# Altium schematic sheet ESC_Tester_SCH.SchDoc
size A4; DrawnBy: Hama; SheetNumber: 1; SheetTotal: 1
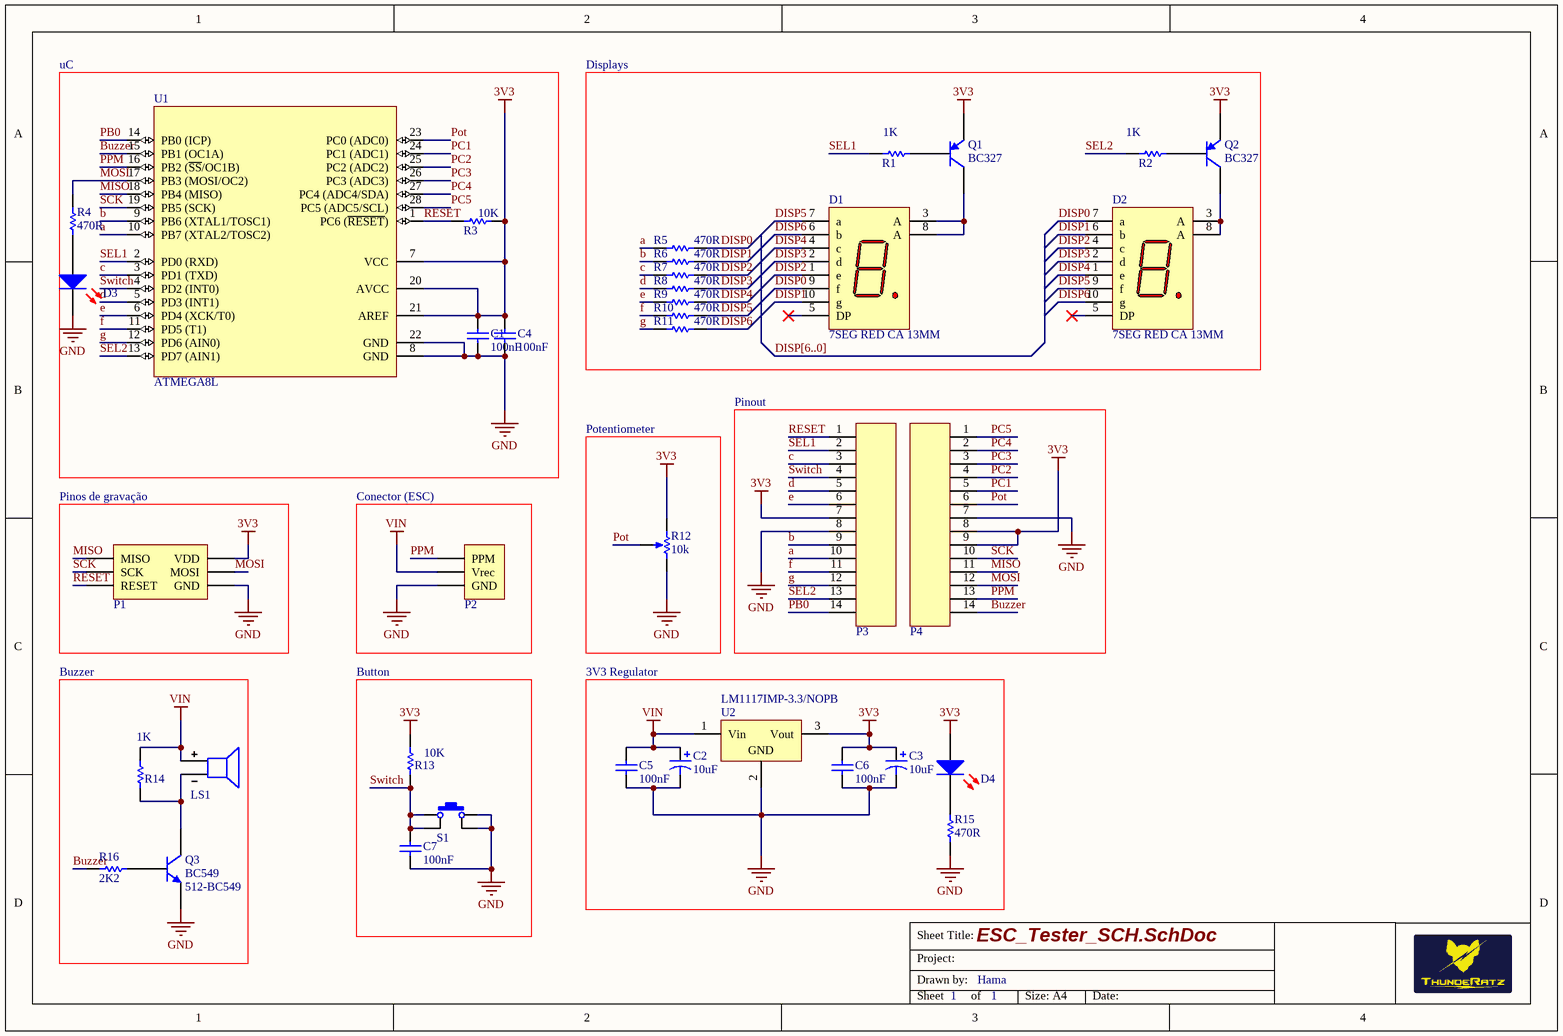
[diagram p0: ESC_Tester_SCH.SchDoc]

## Parts
C1  Capacitance: 100nF  [Cap Film 0.1uF]  (hidden comment: Cap Film 0.1uF)
C2  10uF  [CAP RAD 10UF 35V]
C3  10uF  [CAP RAD 10UF 35V]
C4  Capacitance: 100nF  [Cap Film 0.1uF]  (hidden comment: Cap Film 0.1uF)
C5  Capacitance: 100nF  [Cap Film 0.1uF]  (hidden comment: Cap Film 0.1uF)
C6  Capacitance: 100nF  [Cap Film 0.1uF]  (hidden comment: Cap Film 0.1uF)
C7  Capacitance: 100nF  [Cap Film 0.1uF]  (hidden comment: Cap Film 0.1uF)
D1  7SEG RED CA 13MM  [7SEG RED PTH]
D2  7SEG RED CA 13MM  [7SEG RED PTH]
D3  LED 5MM RED  [LED 5MM RED]  (value not drawn)
D4  LED 5MM RED  [LED 5MM RED]  (value not drawn)
LS1  Buzzer  [BUZZER 12x6MM]  (value not drawn)
P1  87758-4016  [HDR MALE 2x3]  (value not drawn)
P2  920-0018-01  [HDR MALE 1x3]  (value not drawn)
P3  Header Female 1x14  [HDR FEMALE 1x14]  (value not drawn)
P4  Header Female 1x14  [HDR FEMALE 1x14]  (value not drawn)
Q1  BC327  [TO92]
Q2  BC327  [TO92]
Q3  BC549  Supplier Part Number 1: 512-BC549  [TO92]
R1  Resistance (Ohms): 1K  [RES 1K 1/4W CARBON FILM]  (hidden comment: RES 1K 1/4W CARBON FILM)
R2  Resistance (Ohms): 1K  [RES 1K 1/4W CARBON FILM]  (hidden comment: RES 1K 1/4W CARBON FILM)
R3  Resistance (Ohms): 10K  [RES 10K 1/4W CARBON FILM]  (hidden comment: RES 10K 1/4W CARBON FILM)
R4  Resistance (Ohms): 470R  [RES 470R 1/4W CARBON FILM_STAND]  (hidden comment: RES 470R 1/4W CARBON FILM)
R5  Resistance (Ohms): 470R  [RES 470R 1/4W CARBON FILM]  (hidden comment: RES 470R 1/4W CARBON FILM)
R6  Resistance (Ohms): 470R  [RES 470R 1/4W CARBON FILM]  (hidden comment: RES 470R 1/4W CARBON FILM)
R7  Resistance (Ohms): 470R  [RES 470R 1/4W CARBON FILM]  (hidden comment: RES 470R 1/4W CARBON FILM)
R8  Resistance (Ohms): 470R  [RES 470R 1/4W CARBON FILM]  (hidden comment: RES 470R 1/4W CARBON FILM)
R9  Resistance (Ohms): 470R  [RES 470R 1/4W CARBON FILM]  (hidden comment: RES 470R 1/4W CARBON FILM)
R10  Resistance (Ohms): 470R  [RES 470R 1/4W CARBON FILM]  (hidden comment: RES 470R 1/4W CARBON FILM)
R11  Resistance (Ohms): 470R  [RES 470R 1/4W CARBON FILM]  (hidden comment: RES 470R 1/4W CARBON FILM)
R12  Resistance (Ohms): 10k  [Pot 10k]  (hidden comment: Pot 10k)
R13  Resistance (Ohms): 10K  [RES 10K 1/4W CARBON FILM]  (hidden comment: RES 10K 1/4W CARBON FILM)
R14  Resistance (Ohms): 1K  [RES 1K 1/4W CARBON FILM]  (hidden comment: RES 1K 1/4W CARBON FILM)
R15  Resistance (Ohms): 470R  [RES 470R 1/4W CARBON FILM_STAND]  (hidden comment: RES 470R 1/4W CARBON FILM)
R16  Resistance (Ohms): 2K2  [RES 2K2 1/4W CARBON FILM]  (hidden comment: RES 2K2 1/4W CARBON FILM)
S1  SPST-NO  [TACT SWITCH 6X6X7MM]  (value not drawn)
U1  ATMEGA8L  [DIP28]
U2  LM1117IMP-3.3/NOPB  [TO220AB]

## Blocks framed on the sheet
uC: C1 C4 D3 R3 R4 U1
Displays: D1 D2 Q1 Q2 R1 R2 R5-R11
Pinout: P3 P4
Potentiometer: R12
Pinos de gravação: P1
Conector (ESC): P2
Buzzer: LS1 Q3 R14 R16
Button: C7 R13 S1
3V3 Regulator: C2 C3 C5 C6 D4 R15 U2

## Nets
3V3: C1.2 C3.1 C4.2 C6.2 D4.1(A) P1.5(VDD) P3.7 P4.8 P4.9 Q1.3(E) Q2.3(E) R3.2 R12.3(BOT) R13.2 U1.7(VCC) U1.20(AVCC) U1.21(AREF) U2.3(Vout)
GND: C1.1 C2.2 C3.2 C4.1 C5.1 C6.1 C7.1 D3.2(K) P1.1(GND) P2.3(GND) P3.8 P4.7 Q3.3(E) R12.1(TOP) R15.2 S1.3 S1.4 U1.8(GND) U1.22(GND) U2.2(GND)
VIN: C2.1 C5.2 LS1.1 P2.2(Vrec) R14.2 U2.1(Vin)
a: P3.10 R5.1 U1.10(PB7_(XTAL2/TOSC2))
b: P3.9 R6.1 U1.9(PB6_(XTAL1/TOSC1))
Buzzer: P4.14 R16.1 U1.15(PB1_(OC1A))
c: P3.3 R7.1 U1.3(PD1_(TXD))
d: P3.5 R8.1 U1.5(PD3_(INT1))
DISP0: D1.9(f) D2.7(a) R5.2
DISP1: D1.10(g) D2.6(b) R6.2
DISP2: D1.1(e) D2.4(c) R7.2
DISP3: D1.2(d) D2.2(d) R8.2
DISP4: D1.4(c) D2.1(e) R9.2
DISP5: D1.7(a) D2.9(f) R10.2
DISP6: D1.6(b) D2.10(g) R11.2
e: P3.6 R9.1 U1.6(PD4_(XCK/T0))
f: P3.11 R10.1 U1.11(PD5_(T1))
g: P3.12 R11.1 U1.12(PD6_(AIN0))
MISO: P1.6(MISO) P4.11 U1.18(PB4_(MISO))
MOSI: P1.3(MOSI) P4.12 R4.2 U1.17(PB3_(MOSI/OC2))
PB0: P3.14 U1.14(PB0_(ICP))
PC1: P4.5 U1.24(PC1_(ADC1))
PC2: P4.4 U1.25(PC2_(ADC2))
PC3: P4.3 U1.26(PC3_(ADC3))
PC4: P4.2 U1.27(PC4_(ADC4/SDA))
PC5: P4.1 U1.28(PC5_(ADC5/SCL))
Pot: P4.6 R12.2(TAP) U1.23(PC0_(ADC0))
PPM: P2.1(PPM) P4.13 U1.16(PB2_(~{SS}/OC1B))
RESET: P1.2(RESET) P3.1 R3.1 U1.1(PC6_(~{RESET}))
SCK: P1.4(SCK) P4.10 U1.19(PB5_(SCK))
SEL1: P3.2 R1.1 U1.2(PD0_(RXD))
SEL2: P3.13 R2.1 U1.13(PD7_(AIN1))
Switch: C7.2 P3.4 R13.1 S1.1 S1.2 U1.4(PD2_(INT0))
NetD1_3: D1.3(A) D1.8(A) Q1.1(C)
NetD2_3: D2.3(A) D2.8(A) Q2.1(C)
NetD3_1: D3.1(A) R4.1
NetD4_2: D4.2(K) R15.1
NetLS1_2: LS1.2 Q3.1(C) R14.1
NetQ1_2: Q1.2(B) R1.2
NetQ2_2: Q2.2(B) R2.2
NetQ3_2: Q3.2(B) R16.2

Not connected (* = marked no-connect by the designer): D1 5(DP)*; D2 5(DP)*

## Buses and harness runs
bus DISP[6..0]

## Notes on the sheet
- Sheet Title:
- Project:
- Drawn by:
- Sheet
- of
- Size: A4
- Date:

## Library data of the parts
C1 C4-C7 = Cap Film 0.1uF - B32529C104K: Cap Film 0.1uF 63V PET 10% (7.2 X 2.5 X 6.5mm) Radial 5mm 125C Bulk; Manufacturer: TDK EPCOS; Material: PVC,Resin; Voltage Rating (AC): 40V; Life (Hours): 200000Hour; Insulation Resistance: 15GR; Lead Diameter: 0.5mm; Lead Length: 6mm; Supplier 1: Newark; Manufacturer Part Number: B32529C104K; Stock 1: 0; Mount: PCB,Through Hole; Case/Package: Radial; Number of Pins: 2; Dielectric Material: PET; Contact Plating: Matte,Tin; Min Operating Temperature: -55°C; Max Operating Temperature: 125°C; Voltage Rating: 63V; Tolerance: 10%; Packaging: Bulk; Voltage Rating (DC): 63V; Package Quantity: 2000; Termination: Radial; Dielectric: PET; Length: 7.2mm; Height: 6.5mm; Lead Pitch: 5mm; Width: 2.5mm; Height - Seated (Max): 0.256inch; Depth: 2.5mm; Pitch: 5mm; Radiation Hardening: No; REACH SVHC: No SVHC; Lead Free: Lead Free; ComponentLink1URL: http://www.farnell.com/datasheets/8708.pdf?src-supplier=Element14; ComponentLink1Description: http://www.farnell.com/datasheets/8708.pdf?src-supplier=Element14; ComponentLink2URL: https://www.distrelec.biz/Web/Downloads/_t/ds/b3252x_eng_tds.pdf?mime=application%2Fpdf&src-supplier=Distrelec; ComponentLink2Description: https://www.distrelec.biz/Web/Downloads/_t/ds/b3252x_eng_tds.pdf?mime=application%2Fpdf&src-supplier=Distrelec; ComponentLink3URL: http://www.farnell.com/datasheets/1955213.pdf?src-supplier=Farnell; ComponentLink3Description: http://www.farnell.com/datasheets/1955213.pdf?src-supplier=Farnell; ComponentLink4URL: https://www.verical.com/server-webapp/html/getDatasheet?partID=117180&src-supplier=Verical; ComponentLink4Description: https://www.verical.com/server-webapp/html/getDatasheet?partID=117180&src-supplier=Verical; ComponentLink5URL: https://produktinfo.conrad.com/datenblaetter/500000-524999/500871-da-01-en-METALLPOLYESTER_KONDENSATOR_0_10_UF.pdf?src-supplier=Conrad; ComponentLink5Description: https://produktinfo.conrad.com/datenblaetter/500000-524999/500871-da-01-en-METALLPOLYESTER_KONDENSATOR_0_10_UF.pdf?src-supplier=Conrad; Supplier Part Number 1: 21C0469
C2 C3 = CAP ELE RAD 10uF 16V: Manufacturer Part Number: IMP1295; Product Range: MCGPR Series; Capacitance Tolerance: ± 20%; Voltage Rating: 16; Capacitor Terminals: Radial Leaded; Lifetime @ Temperature: 2000 hours @ 85; SVHC: No SVHC (15-Jun-2015); Leakage Current: 6; Supplier 1: Mult Comercial; Manufacturer: -; RoHS: YES; Stock 1: 33826; Pricing 1: 1=0.50 (BRL); Capacitance: 10uF; Diameter: 5; Packaging: Each; ESR: -; Height: 11; Lead Spacing: 2; Operating Temperature Min: -40; Operating Temperature Max: 85; Capacitance Tolerance ±: ± 20%; Operating Temperature Range: -40°C to +85°C<!--FANDB--><div class="features-and-benefits-container"><div class="features-and-benefits-description"><span class="features-benefits-value">The Multicomp MCGPR series capacitors are general purpose, radial leaded polarized aluminium electrolytic capacitors. MCGPR series parts cover broad range of voltage ratings and capacitance values.</span></div><div class="features-and-benefits-list"><ul class="features-and-benefits-list-list"><li class="features-and-benefits-list-item">Capacitance value ranges from 0.1µF to 22000µF for 6.3VDC to 100VDC</li><li class="features-and-benefits-list-item">Capacitance value ranges from 0.47µF to 820µF for 160VDC to 450VDC</li><li class="features-and-benefits-list-item">Tolerance of ±20%</li><li class="features-and-benefits-list-item">Endurance of 2000h at 85°C</li><li class="features-and-benefits-list-item">Available in -40°C to 85°C and -25°C to 85; ComponentLink1URL: http://loja.multcomercial.com.br/capacitor-eletrolitico-10uf-16v.html; ComponentLink1Description: http://loja.multcomercial.com.br/capacitor-eletrolitico-10uf-16v.html; Supplier Part Number 1: Capacitor Eletrolítico 10uF/16V
D1 D2 = 7SEG RED CA 13MM: PHOTONIC - PHDE113A - DISPLAY, SEVEN SEGMENT, 13MM, RED; No. of Digits / Alpha: 1; Character Size: 13; Common Connection: Common Anode; Luminous Intensity: 1800 ucd; Forward Current If: 30mA; Forward Voltage: 2.1; Supplier 1: Mult Comercial; Manufacturer: Photonic; Manufacturer Part Number: PHDE113A; RoHS: YES; Stock 1: 0; Pricing 1: 1=3.70 (BRL); LED Color: Red; Packaging: Each; Colour: Red; ComponentLink1URL: http://loja.multcomercial.com.br/display-de-7-segmentos-anodo-comum-vermelho-alta-intensidade-phde113a-politronic.html; ComponentLink1Description: http://loja.multcomercial.com.br/display-de-7-segmentos-anodo-comum-vermelho-alta-intensidade-phde113a-politronic.html; ComponentLink2URL: http://www.politronic.com.br/especs/dis/PHDX113.pdf; ComponentLink2Description: http://www.politronic.com.br/especs/dis/PHDX113.pdf; Supplier Part Number 1: Display de 7 Segmentos Anodo Comum Vermelho Alta Intensidade PHDE113A - Politronic
D3 D4 = LED 5MM RED: Manufacturer: Paralight; Manufacturer Part Number: IMP585; Bulb Size: 3mm; Wavelength Typ: 625; Forward Voltage: 2; Forward Current If: 20; Luminous Intensity: 3; LED Mounting: Through Hole; Lens Shape: Round; Viewing Angle: 60°; SVHC: No SVHC (15-Jun-2015); External Diameter: 2.9; External Length / Height: 4.6; Forward Voltage VF Max: 2.5; LED / Lamp Size: 3mm / T-1; LED Type: Standard; Lead Cross-section Depth: 0.5; Luminous Intensity @ If Min: 0.7; PIV Max: 5; Peak Forward Current: 7; Voltage Vf Typ: 2.2V<!--FANDB--><div class="features-and-benefits-container"><div class="features-and-benefits-description"><span class="features-benefits-value">The L-934LID from Kingbright is a through hole round shape high efficiency red colour LED. The device is made of gallium arsenide phosphide on gallium phosphide orange light emitting diode. This LED is widely used because of low power consumption, long life and solid state reliability.</span></div><div class="features-and-benefits-list"><ul class="features-and-benefits-list-list"><li class="features-and-benefits-list-item">Standard bulb size of T-1 (3mm)</li><li class="features-and-benefits-list-item">Reliable and rugged</li><li class="features-and-benefits-list-item">Viewing angle is 60°</li><li class="features-and-benefits-list-item">Luminous intensity of 3mcd at 2mA</li><li class="features-and-benefits-list-item">Forward voltage is 2.0V</li><li class="features-and-benefits-list-item">Forward current (If) is 20mA</li><li class="features-and-benefits-list-item">Dominant wavelength is 625nm at IF=20mA</li><li class="features-and-benefits-list-item">Peak wavelength is 627nm at IF=20; Supplier 1: Mult Comercial; RoHS: YES; Stock 1: 35260; Pricing 1: 1=0.15 (BRL); LED Colour: Red; Packaging: Each; MSL: -; Current If Luminous Intensity: 2; Dominant Wavelength: 625; Forward Current If Max: 20; Lead Cross-section Width: 0.5; Lead Spacing: 2.54; Luminous Intensity Typ: 3; Mounting Type: PCB Through Hole; No. of Pins: 2; Operating Temperature Max: 85; Operating Temperature Min: -40; Operating Temperature Range: -40°C to +85; Peak Wavelength: 625; ComponentLink1URL: http://loja.multcomercial.com.br/led-3mm-vermelho-difuso-l-314hd-paralight.html; ComponentLink1Description: http://loja.multcomercial.com.br/led-3mm-vermelho-difuso-l-314hd-paralight.html; Supplier Part Number 1: Led 3mm Vermelho Difuso L-314HD - Paralight
LS1 = AUDIO PIEZO TRANSDUCER 30V TH: Manufacturer: TDK Corporation; Manufacturer Part Number: PS1240P02BT; Driver Circuitry: Transducer, Externally Driven; Input Type: Zero-Peak Signal; Voltage - Rated: 3V; Voltage Range: 30V (Max); Frequency: 4kHz; Operating Mode: Single Tone; Sound Pressure Level: 60dB @ 3V, 10cm; Port Location: Top; Supplier 1: Digi-Key; RoHS: RoHS Compliant; Category: Audio Products; Stock 1: 23730; Pricing 1: 1=0.72, 10=0.622, 100=0.3889, 250=0.37776 (USD); Packaging: Cut Tape (CT); Part Status: Active; Technology: Piezo; Duration: -; Current - Supply: -; Operating Temperature: -10°C ~ 70°C; Approvals: -; Ratings: -; Mounting Type: Through Hole; Termination: PC Pins; Size / Dimension: 0.480" Dia (12.20mm); Height - Seated (Max): 0.307" (7.80mm); ComponentLink1URL: https://product.tdk.com/info/en/catalog/datasheets/ef532_ps.pdf; ComponentLink1Description: https://product.tdk.com/info/en/catalog/datasheets/ef532_ps.pdf; Supplier Part Number 1: 445-2525-1-ND
P1 = 87758-4016: Headers & Wire Housings VERT HEADER 40P Lead Free; Manufacturer: Molex; Current Rating: 2 A; Mounting Angle: Vertical; Number of Positions: 40 Position; Voltage Rating: 125 V; Pitch: 2 mm; Supplier 1: Mouser; Manufacturer Part Number: 87758-4016; RoHS: RoHS Compliant; Category: Headers & Wire Housings; Stock 1: 704; Pricing 1: 1=3.82, 10=2.96, 100=2.51, 500=2.29, 1000=2.08, 2000=1.98, 5000=1.87 (AUD); Accessory Type: -; Contact Plating: Gold; Contact Type: -; Housing Material: Nylon; Number of Rows: 2 Row; Packaging: Tray; Product: Headers; Series: 87758; Termination Style: Through Hole; Type: Breakaway; Brand: Molex; Contact Material: Phosphor Bronze; Mounting Style: Through Hole; Row Spacing: 2 mm; Contact Gender: Pin (Male); Product Category: 2mm Connectors; Standard Pack Qty: 900; Tradename: Milli-Grid; RoHS - Mouser: Y; Minimum Order Quantity: 1; Reeling: False; ComponentLink1URL: http://www.mouser.com/ds/2/276/0877584016_PCB_HEADERS-176369.pdf; ComponentLink1Description: http://www.mouser.com/ds/2/276/0877584016_PCB_HEADERS-176369.pdf; Supplier Part Number 1: 538-87758-4016
P2 = 920-0018-01_1: Headers & Wire Housings 40Pin 2mm Spacing Single Row Hdrs, 5pc; Manufacturer: SchmartBoard; Mounting Angle: Vertical; Number of Positions: 40 Position; Supplier 1: Mouser; Manufacturer Part Number: 920-0018-01; RoHS: RoHS Compliant; Category: Headers & Wire Housings; Stock 1: 14; Pricing 1: 1=7.43, 5=7.05 (AUD); Accessory Type: -; Contact Plating: Gold; Contact Type: -; Number of Rows: 1 Row; Product: Headers; Termination Style: Through Hole; Type: Breakaway; Brand: SchmartBoard; Mounting Style: Straight Pin; Pitch: 2 mm; Row Spacing: -; Contact Gender: Pin (Male); Product Category: Accessories; RoHS - Mouser: Y; Minimum Order Quantity: 1; Reeling: False; ComponentLink1URL: http://www.mouser.com/ds/2/356/SchmartBoard_920-0018-01-305856.pdf; ComponentLink1Description: http://www.mouser.com/ds/2/356/SchmartBoard_920-0018-01-305856.pdf; Supplier Part Number 1: 872-920-0018-01
P3 P4 = Header Female 1x14: Headers & Wire Housings 40Pin 2mm Spacing Single Row Hdrs, 5pc; Manufacturer: Cromax; Mounting Angle: Vertical; Number of Positions: 40 Position; Supplier 1: -; Manufacturer Part Number: -; RoHS: RoHS Compliant; Category: Headers & Wire Housings; Stock 1: 14; Pricing 1: 1=1.60, 2=0.80 (BRL); Accessory Type: -; Contact Plating: Gold; Contact Type: -; Number of Rows: 1 Row; Product: Headers; Termination Style: Through Hole; Type: Breakaway; Brand: Cromax; Mounting Style: Straight Pin; Pitch: 2 mm; Row Spacing: -; Contact Gender: Pin (Female); Product Category: Accessories; RoHS - Mouser: Y; Minimum Order Quantity: 1; Reeling: False; ComponentLink1URL: -; ComponentLink1Description: -; Supplier Part Number 1: -
Q1 Q2 = BC327 BJT PNP TO92: Bipolar Transistors - BJT PNP -45V -800mA HFE/630; Manufacturer: Fairchild Semiconductor; Collector- Base Voltage VCBO: - 50 V; Configuration: Single; DC Current Gain hFE Max: 630; Emitter- Base Voltage VEBO: - 5 V; Collector-Emitter Saturation Voltage: - 0.7 V; DC Collector/Base Gain hfe Min: 100; Gain Bandwidth Product fT: 100 MHz; Maximum DC Collector Current: 0.8 A; Pd - Power Dissipation: 625 mW; Product Status: Obsolete; Supplier 1: Mult Comercial; Manufacturer Part Number: BC327; RoHS: RoHS Compliant; Category: Bipolar Transistors - BJT; Stock 1: 0; Collector- Emitter Voltage VCEO Max: - 45 V; Package / Case: TO-92; Packaging: Bulk; Series: BC327; Brand: Fairchild Semiconductor; Mounting Style: Through Hole; Transistor Polarity: PNP; Maximum Operating Temperature: + 150 C; Minimum Operating Temperature: - 55 C; Standard Pack Qty: 2000; RoHS - Mouser: Y; Minimum Order Quantity: 1; Reeling: False; ComponentLink1URL: http://loja.multcomercial.com.br/transistor-bc237-25-pnp-to-92-cod-loja-14-fairchild.html; ComponentLink1Description: http://loja.multcomercial.com.br/transistor-bc237-25-pnp-to-92-cod-loja-14-fairchild.html; Supplier Part Number 1: Transistor BC327-25 PNP TO-92 - Cód. Loja 14 - FAIRCHILD; Pricing 1: 1=0.20 (BRL)
Q3 = BC549: TRANS NPN 30V 0.1A TO-92; Manufacturer: Fairchild Semiconductor; Configuration: Single; Emitter- Base Voltage VEBO: 5 V; Collector-Emitter Saturation Voltage: 200 mV; Gain Bandwidth Product fT: 300 MHz; DC Collector/Base Gain hfe Min: 110; DC Current Gain hFE Max: 800; Maximum Power Dissipation: 0.5 W; Supplier 1: Mouser; Manufacturer Part Number: BC549; Product Category: Bipolar Transistors - BJT; RoHS: Details; Transistor Polarity: NPN; Collector- Base Voltage VCBO: 30 V; Collector- Emitter Voltage VCEO Max: 30 V; Maximum DC Collector Current: 0.1 A; Maximum Operating Temperature: + 150 C; Mounting Style: Through Hole; Package / Case: TO-92-3; Brand: Fairchild Semiconductor; Minimum Operating Temperature: - 65 C; Packaging: Bulk; Series: BC549; Factory Pack Quantity: 2000; ComponentLink1URL: https://datasheet.ciiva.com/982/bc546-982130.pdf; ComponentLink1Description: https://datasheet.ciiva.com/982/bc546-982130.pdf; ComponentLink2URL: https://datasheet.ciiva.com/17179/bc549-17179663.pdf; ComponentLink2Description: https://datasheet.ciiva.com/17179/bc549-17179663.pdf
R1 R2 R14 = RES 1K 1/4W CARBON FILM: RES 1K OHM 1/4W 5% CARBON FILM; Manufacturer: Ty-Ohm; Manufacturer Part Number: CR25; Power (Watts): 0.25W, 1/4W; Temperature Coefficient: 0/ -500ppm/°C; Supplier 1: Mult Comercial; RoHS: RoHS Compliant; Category: Resistors; Stock 1: 617543; Pricing 1: 1=0.20 (BRL); Packaging: Cut Tape (CT); Tolerance: ±5%; Composition: Carbon Film; Features: Flame Retardant Coating, Safety; Operating Temperature: -55°C ~ 155°C; Package / Case: Axial; Supplier Device Package: Axial; Size / Dimension: 0.091" Dia x 0.256" L (2.30mm x 6.50mm); Height: -; Number of Terminations: 2; ComponentLink1URL: http://loja.multcomercial.com.br/resistor-de-1-4-de-watt-cr25-5-de-tolerancia.html; ComponentLink1Description: http://loja.multcomercial.com.br/resistor-de-1-4-de-watt-cr25-5-de-tolerancia.html; Supplier Part Number 1: Resistor de Filme de Carbono 1/4 de Watt CR25 5% de tolerância - 0.22R Ω à 10M Ω
R3 R13 = RES 10K 1/4W CARBON FILM: RES 10K OHM 1/4W 5% CARBON FILM; Manufacturer: Ty-Ohm; Manufacturer Part Number: CR25; Power (Watts): 0.25W, 1/4W; Temperature Coefficient: 0/ -500ppm/°C; Supplier 1: Mult Comercial; RoHS: RoHS Compliant; Category: Resistors; Stock 1: 617543; Pricing 1: 1=0.20 (BRL); Packaging: Cut Tape (CT); Tolerance: ±5%; Composition: Carbon Film; Features: Flame Retardant Coating, Safety; Operating Temperature: -55°C ~ 155°C; Package / Case: Axial; Supplier Device Package: Axial; Size / Dimension: 0.091" Dia x 0.256" L (2.30mm x 6.50mm); Height: -; Number of Terminations: 2; ComponentLink1URL: http://loja.multcomercial.com.br/resistor-de-1-4-de-watt-cr25-5-de-tolerancia.html; ComponentLink1Description: http://loja.multcomercial.com.br/resistor-de-1-4-de-watt-cr25-5-de-tolerancia.html; Supplier Part Number 1: Resistor de Filme de Carbono 1/4 de Watt CR25 5% de tolerância - 0.22R Ω à 10M Ω
R4-R11 R15 = RES 470R 1/4W CARBON FILM: RES 470R OHM 1/4W 5% CARBON FILM; Manufacturer: Ty-Ohm; Manufacturer Part Number: CR25; Power (Watts): 0.25W, 1/4W; Temperature Coefficient: 0/ -500ppm/°C; Supplier 1: Mult Comercial; RoHS: RoHS Compliant; Category: Resistors; Stock 1: 617543; Pricing 1: 1=0.20 (BRL); Packaging: Cut Tape (CT); Tolerance: ±5%; Composition: Carbon Film; Features: Flame Retardant Coating, Safety; Operating Temperature: -55°C ~ 155°C; Package / Case: Axial; Supplier Device Package: Axial; Size / Dimension: 0.091" Dia x 0.256" L (2.30mm x 6.50mm); Height: -; Number of Terminations: 2; ComponentLink1URL: http://loja.multcomercial.com.br/resistor-de-1-4-de-watt-cr25-5-de-tolerancia.html; ComponentLink1Description: http://loja.multcomercial.com.br/resistor-de-1-4-de-watt-cr25-5-de-tolerancia.html; Supplier Part Number 1: Resistor de Filme de Carbono 1/4 de Watt CR25 5% de tolerância - 0.22R Ω à 10M Ω
R12 = Pot 10k: POT 10K OHM 1/20W PLASTIC LINEAR; Manufacturer: TT Electronics/BI; Manufacturer Part Number: P120PK-Y25BR10K; Tolerance: ±20%; Built in Switch: None; Power (Watts): 0.05W, 1/20W; Number of Turns: 1; Rotation: 300°; Adjustment Type: Top Adjustment; Resistive Material: Conductive Plastic; Actuator Type: Knurled; Actuator Length: 0.984" (25.00mm); Actuator Diameter: 0.236" (6.00mm); Supplier 1: Digi-Key; RoHS: RoHS Compliant; Category: Potentiometers, Variable Resistors; Stock 1: 1210; Pricing 1: 1=0.6, 10=0.553, 25=0.4932, 50=0.476, 100=0.442, 250=0.43352, 500=0.3995, 1000=0.34, 5000=0.2805 (USD); Packaging: Tray; Part Status: Active; Taper: Linear; Temperature Coefficient: -; Termination Style: PC Pins, Board Locks; Bushing Thread: -; Mounting Type: Through Hole, Snap In; ComponentLink1URL: http://www.ttelectronics.com/sites/default/files/download-files/Datasheet_RotaryPanelPot_P120series.pdf; ComponentLink1Description: http://www.ttelectronics.com/sites/default/files/download-files/Datasheet_RotaryPanelPot_P120series.pdf; Supplier Part Number 1: 987-1710-ND
R16 = RES 2K2 1/4W CARBON FILM: RES 2K2 OHM 1/4W 5% CARBON FILM; Manufacturer: Ty-Ohm; Manufacturer Part Number: CR25; Power (Watts): 0.25W, 1/4W; Temperature Coefficient: 0/ -500ppm/°C; Supplier 1: Mult Comercial; RoHS: RoHS Compliant; Category: Resistors; Stock 1: 617543; Pricing 1: 1=0.20 (BRL); Packaging: Cut Tape (CT); Tolerance: ±5%; Composition: Carbon Film; Features: Flame Retardant Coating, Safety; Operating Temperature: -55°C ~ 155°C; Package / Case: Axial; Supplier Device Package: Axial; Size / Dimension: 0.091" Dia x 0.256" L (2.30mm x 6.50mm); Height: -; Number of Terminations: 2; ComponentLink1URL: http://loja.multcomercial.com.br/resistor-de-1-4-de-watt-cr25-5-de-tolerancia.html; ComponentLink1Description: http://loja.multcomercial.com.br/resistor-de-1-4-de-watt-cr25-5-de-tolerancia.html; Supplier Part Number 1: Resistor de Filme de Carbono 1/4 de Watt CR25 5% de tolerância - 0.22R Ω à 10M Ω
S1 = SWITCH TACTILE SPST-NO 0.02A 15V: Manufacturer: Panasonic Electronic Components; Manufacturer Part Number: EVQ-PAC07K; Switch Function: Off-Mom; Contact Rating @ Voltage: 0.02A @ 15VDC; Actuator Type: Standard; Actuator Height off PCB, from Pins: 7.00mm; Actuator Orientation: Top Actuated; Outline: 6.00mm x 6.00mm; Illumination: Non-Illuminated; Operating Force: 100gf; Switch Travel: 0.25mm; Mechanical Life: 100,000 Cycles; Supplier 1: Digi-Key; RoHS: RoHS Compliant; Category: Switches; Stock 1: 19805; Pricing 1: 1=0.27, 10=0.254, 25=0.2168, 50=0.1896, 100=0.176, 250=0.15572, 500=0.14894, 1000=0.12186, 5000=0.10832 (USD); Packaging: Bulk; Part Status: Active; Circuit: SPST-NO; Mounting Type: Through Hole; Termination Style: PC Pin; Illumination Voltage (Nominal): -; Illumination Type, Color: -; Ingress Protection: -; Features: -; Actuator Material: -; Operating Temperature: -20°C ~ 70°C; ComponentLink1URL: http://industrial.panasonic.com/cdbs/www-data/pdf/ATK0000/ATK0000CE10.pdf; ComponentLink1Description: http://industrial.panasonic.com/cdbs/www-data/pdf/ATK0000/ATK0000CE10.pdf; Supplier Part Number 1: P8011S-ND
U1 = MCU ATMEGA8L-8PU PDIP28_1: 8-bit Microcontrollers - MCU 8kB Flash 0.5kB EEPROM 23 I/O Pins; Manufacturer: Atmel; Data RAM Size: 1 kB; Data RAM Type: SRAM; Data ROM Size: 512 B; Interface Type: SPI, TWI, USART; Number of I/Os: 23 I/O; Core: AVR; Data Bus Width: 8 bit; Maximum Clock Frequency: 8 MHz; Number of Timers/Counters: 3 Timer; Operating Supply Voltage: 2.7 V to 5.5 V; Processor Series: megaAVR; Supply Voltage - Max: 5.5 V; Supply Voltage - Min: 2.7 V; Supplier 1: Mult Comercial; Manufacturer Part Number: ATmega8L-8PU; RoHS: RoHS Compliant; Category: 8-bit Microcontrollers - MCU; Pricing 1: 1=8.70 (BRL); Package / Case: DIP-28; Packaging: Tray; Product: MCU; Program Memory Type: Flash; Series: ATMEGA 8; Brand: Atmel; Data ROM Type: EEPROM; Mounting Style: SMD/SMT; Program Memory Size: 8 kB; Maximum Operating Temperature: + 85 C; Minimum Operating Temperature: - 40 C; Product Category: Microcontrollers - RISC; Standard Pack Qty: 1; Tradename: ATMEGA; Minimum Order Quantity: 1; Reeling: False; ComponentLink1URL: http://loja.multcomercial.com.br/microcontrolador-atmega88pa-pu-dip28-cod-loja-748-atmel-2.html; ComponentLink1Description: http://loja.multcomercial.com.br/microcontrolador-atmega88pa-pu-dip28-cod-loja-748-atmel-2.html; Supplier Part Number 1: Microcontrolador ATMEGA8L-8PU DIP28 - Cód. Loja 472- Atmel; Supplier Part Number 2: Soquete estampado slim MAC28 28 pinos - Cód. Loja 2260 E 2261; ComponentLink2Description: http://loja.multcomercial.com.br/soquete-estampado-slim-mac28-28-pinos-cod-loja-2260-e-2261.html; ComponentLink2URL: http://loja.multcomercial.com.br/soquete-estampado-slim-mac28-28-pinos-cod-loja-2260-e-2261.html
U2 = LM1117IMP-3.3/NOPB: TEXAS INSTRUMENTS   LM1117IMP-3.3/NOPB   LDO, 1.2VDO, 3.3V, 1%, 0.8A, 3SOT223; Maximum Dropout Voltage @ Current: 1.3V@100mA|1.35V@500mA|1.4V@800mA; Maximum Input Voltage: 15V; Maximum Output Current: 1.5A; Maximum Quiescent Current: 15mA; Number of Outputs: 1; Typical Quiescent Current: 5mA; Junction to Ambient: 136C/W(Typ); Junction to Case: 15C/W(Typ); Pin_Count: 4; Product Width: 3.56mm; Polarity: Positive; Product Height: 1.6mm; Product Length: 6.5mm; Output Type: Fixed; Line Regulation: 1mV(Typ); Typical Dropout Voltage @ Current: 1.1V@100mA|1.15V@500mA|1.2V@800mA; Supplier 1: Mouser; Manufacturer: Texas Instruments; Manufacturer Part Number: LM1117IMP-3.3/NOPB; Stock 1: 27688; Pricing 1: 1=1.1, 10=0.94, 50=0.94, 100=0.719, 1000=0.501, 10000=0.428 (USD); Family: LM1117; Output Voltage: 3.3V; Type: Linear; Minimum Operating Temperature: -40C; Maximum Operating Temperature: 125C; Mounting: Surface Mount; Packaging: Tape and Reel; Supplier_Package: SOT-223; Product Type: Linear Regulator; Accuracy: 1%; Function: LDO; Load Regulation: 1mV(Typ); ComponentLink1URL: http://www.jameco.com/Jameco/Products/ProdDS/1281318.pdf?src-supplier=Jameco; ComponentLink1Description: http://www.jameco.com/Jameco/Products/ProdDS/1281318.pdf?src-supplier=Jameco; ComponentLink2URL: http://www.farnell.com/datasheets/1670636.pdf?src-supplier=Element14; ComponentLink2Description: http://www.farnell.com/datasheets/1670636.pdf?src-supplier=Element14; ComponentLink3URL: http://www.ti.com/lit/ds/symlink/lm1117.pdf?src-supplier=Digi-Key; ComponentLink3Description: http://www.ti.com/lit/ds/symlink/lm1117.pdf?src-supplier=Digi-Key; ComponentLink4URL: http://www.farnell.com/datasheets/1882372.pdf?src-supplier=Element14; ComponentLink4Description: http://www.farnell.com/datasheets/1882372.pdf?src-supplier=Element14; ComponentLink5URL: http://www.easyflip.co.uk/Farnell_element14_2013_UK/book.html?page=615&src-supplier=Farnell; ComponentLink5Description: http://www.easyflip.co.uk/Farnell_element14_2013_UK/book.html?page=615&src-supplier=Farnell; ComponentLink6URL: http://www.ti.com/lit/ds/symlink/lm1117-n.pdf?src-supplier=Avnet; ComponentLink6Description: http://www.ti.com/lit/ds/symlink/lm1117-n.pdf?src-supplier=Avnet; ComponentLink7URL: https://www.distrelec.biz/Web/Downloads/_t/ds/lm1117_eng_tds.pdf?mime=application%2Fpdf&src-supplier=Distrelec; ComponentLink7Description: https://www.distrelec.biz/Web/Downloads/_t/ds/lm1117_eng_tds.pdf?mime=application%2Fpdf&src-supplier=Distrelec; Supplier Part Number 1: 926-LM1117IMP3.3NOPB